# EAGLE schematic CampingLight (EAGLE 6.5.0)
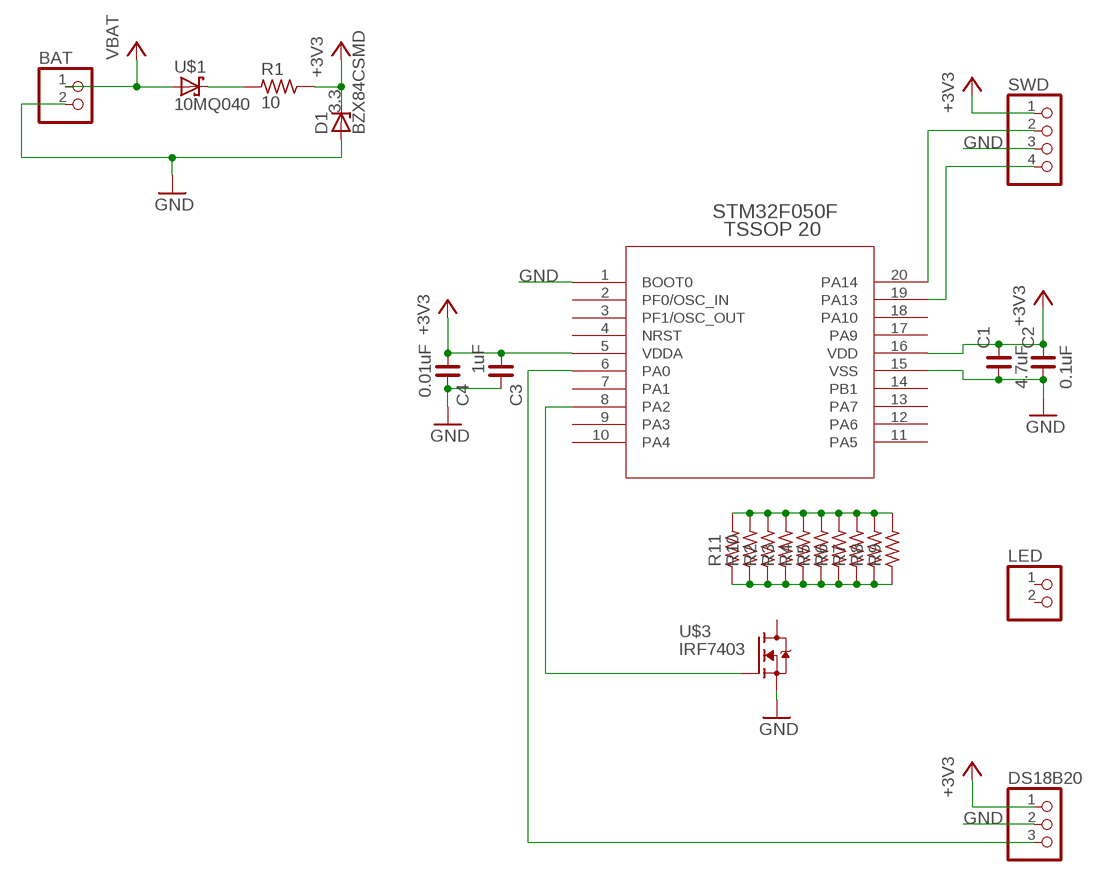
[diagram p0: schematic, sheet 1]

## Parts
BAT  PINHD-1X02_2.54-SMD  [1X02SMD]
C1  4.7uF  C_1206  [C1206]
C2  0.1uF  C_0805  [C0805]
C3  1uF  C_0805  [C0805]
C4  0.01uF  C_0805  [C0805]
D1  BZX84CSMD  [TO236]
DS18B20  PINHD-1X03_2.54-SMD  [1X03SMD]
LED  PINHD-1X02_2.54-SMD  [1X02SMD]
R1  10  R_1206  [R1206]
R2  R_1206  [R1206]
R3  R_1206  [R1206]
R4  R_1206  [R1206]
R5  R_1206  [R1206]
R6  R_1206  [R1206]
R7  R_1206  [R1206]
R8  R_1206  [R1206]
R9  R_1206  [R1206]
R10  R_1206  [R1206]
R11  R_1206  [R1206]
SWD  PINHD-1X04_2.54-SMD  [1X04SMD]
U$1  10MQ040  [SMA]
U$2  STM32F050F4P6  [TSSOP20]
U$3  IRF7403  [SO-8]

## Nets
+3V3: C1.2 C2.2 C3.1 C4.1 D1.C DS18B20.1 R1.2 SWD.1 U$2.5(VDDA) U$2.16(VDD)
GND: BAT.2 C1.1 C2.1 C3.2 C4.2 D1.A DS18B20.2 SWD.3 U$2.1(BOOT0) U$2.15(VSS) U$3.1(S) U$3.2(S) U$3.3(S)
N$1: SWD.4 U$2.19(PA13)
N$2: R1.1 U$1.C
N$3: SWD.2 U$2.20(PA14)
N$4: DS18B20.3 U$2.6(PA0)
N$5: R2.1 R3.1 R4.1 R5.1 R6.1 R7.1 R8.1 R9.1 R10.1 R11.1
N$6: U$2.8(PA2) U$3.4(G)
N$7: R2.2 R3.2 R4.2 R5.2 R6.2 R7.2 R8.2 R9.2 R10.2 R11.2
VBAT: BAT.1 U$1.A
Unconnected: LED.1 LED.2 U$2.2(PF0/OSC_IN) U$2.3(PF1/OSC_OUT) U$2.4(NRST) U$2.7(PA1) U$2.9(PA3) U$2.10(PA4) U$2.11(PA5) U$2.12(PA6) U$2.13(PA7) U$2.14(PB1) U$2.17(PA9) U$2.18(PA10) U$3.5(D) U$3.6(D) U$3.7(D) U$3.8(D)

## Library data of the parts
BAT LED = pinhead-2:PINHD-1X02: PIN HEADER
C1-C4 = rc-master-smd:C_: NON-POLARIZED CAP
D1 = diode:BZX84CSMD: Z DIODE; BZX84C3V3: 3.3
DS18B20 = pinhead-2:PINHD-1X03: PIN HEADER
R1-R11 = rc-master-smd:R_: RESISTOR
SWD = pinhead-2:PINHD-1X04: PIN HEADER
U$1 = my-library:10MQ040: SCHOTTKY
U$2 = STM32F0:STM32F050F4P6: STM32F050F4P6
U$3 = my-library:IRF7403